# EAGLE design Adafruit ESP8266 Feather (EAGLE 7.7.0)
COMPANY: ADAFRUIT INDUSTRIES; DRAWN: KTOWN; REV: B
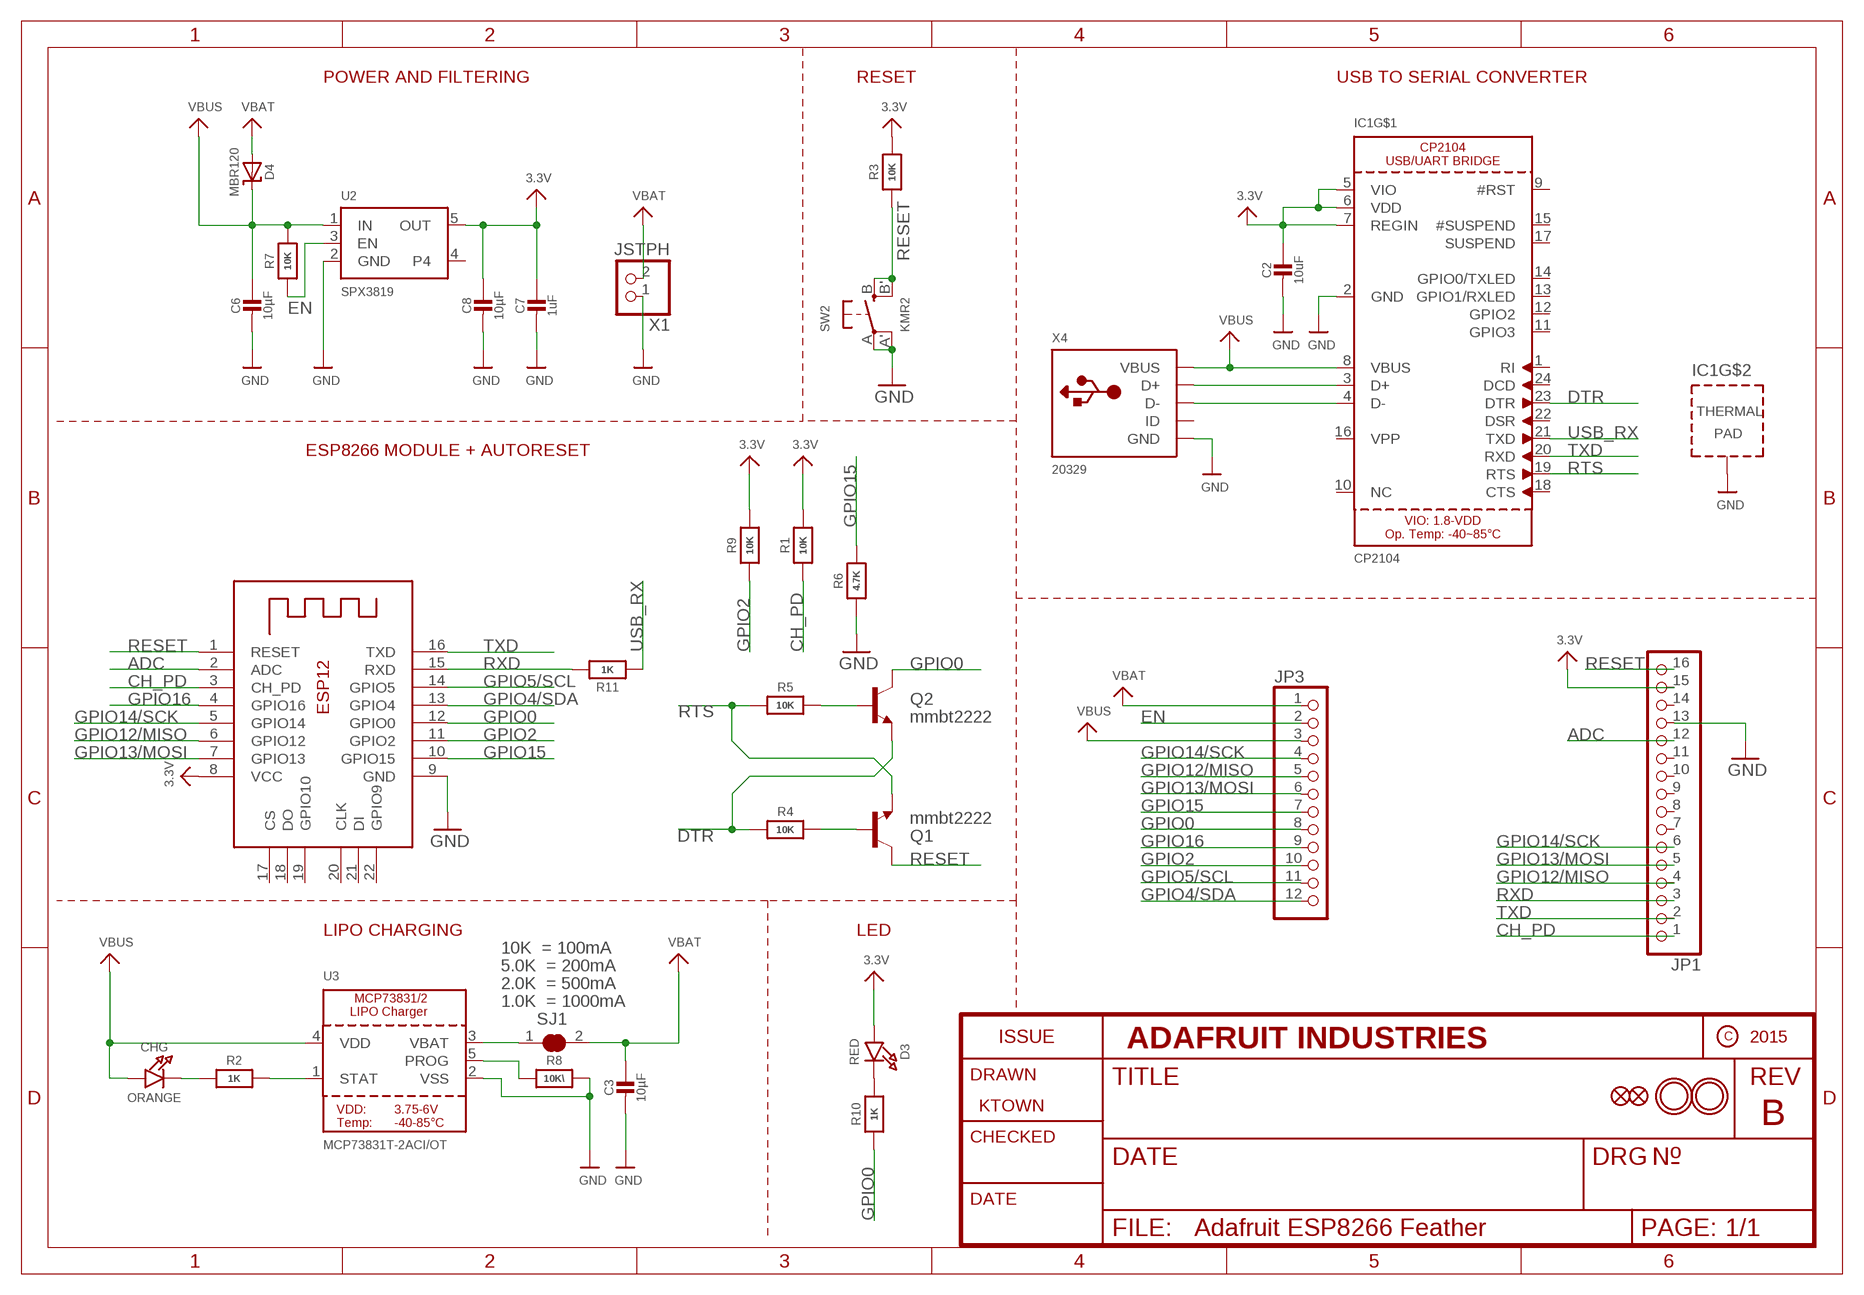
[diagram p0: schematic, sheet 1]

## Parts
C2  10uF  CAP_CERAMIC0805-NOOUTLINE  [0805-NO]
C3  10µF  CAP_CERAMIC0805-NOOUTLINE  [0805-NO]
C6  10µF  CAP_CERAMIC0805-NOOUTLINE  [0805-NO]
C7  1uF  CAP_CERAMIC0603_NO  [0603-NO]
C8  10µF  CAP_CERAMIC0805-NOOUTLINE  [0805-NO]
CHG  ORANGE  LED0805_NOOUTLINE  [CHIPLED_0805_NOOUTLINE]
D3  RED  LED0805_NOOUTLINE  [CHIPLED_0805_NOOUTLINE]
D4  MBR120  DIODE-SCHOTTKYSOD-123  [SOD-123]
IC1  CP2104  [QFN24_4MM_SMSC]
JP1  HEADER-1X16ROUND  [1X16_ROUND]
JP3  HEADER-1X12  [1X12_ROUND]
Q1  mmbt2222  TRANSISTOR_NPNSOT23-3  [SOT23-3]
Q2  mmbt2222  TRANSISTOR_NPNSOT23-3  [SOT23-3]
R1  10K  RESISTOR_0603_NOOUT  [0603-NO]
R2  1K  RESISTOR_0603_NOOUT  [0603-NO]
R3  10K  RESISTOR_0603_NOOUT  [0603-NO]
R4  10K  RESISTOR_0603_NOOUT  [0603-NO]
R5  10K  RESISTOR_0603MP  [_0603MP]
R6  4.7K  RESISTOR_0603_NOOUT  [0603-NO]
R7  10K  RESISTOR_0603_NOOUT  [0603-NO]
R8  10K\  RESISTOR_0603_NOOUT  [0603-NO]
R9  10K  RESISTOR_0603_NOOUT  [0603-NO]
R10  1K  RESISTOR_0603_NOOUT  [0603-NO]
R11  1K  RESISTOR_0603MP  [_0603MP]
SJ1  SOLDERJUMPER_CLOSED  [SOLDERJUMPER_CLOSEDWIRE]
SW2  KMR2  SWITCH_TACT_SMT4.6X2.8  [BTN_KMR2_4.6X2.8]
U2  SPX3819  VREG_SOT23-5  [SOT23-5]
U3  MCP73831T-2ACI/OT  MCP73831/2  [SOT23-5]
U$31  MOUNTINGHOLE2.5  [MOUNTINGHOLE_2.5_PLATED]
U$32  MOUNTINGHOLE2.5  [MOUNTINGHOLE_2.5_PLATED]
U$34  FIDUCIAL""  [FIDUCIAL_1MM]
U$35  FIDUCIAL""  [FIDUCIAL_1MM]
X1  JSTPH  CON_JST_PH_2PIN  [JSTPH2]
X2  ESP-12  ESP-12E  [ESP-12E]
X4  20329  MICRO-USB-SMD-B-(10118193-0001LF)-ADASYM  [MICRO-USB5+6P-SMD-0.65-B]

## Nets
3.3V: C2.1 C7.1 C8.1 D3.A IC1.5(VIO) IC1.6(VDD) IC1.7(REGIN) JP1.15 R1.2 R3.2 R9.2 U2.5(OUT) X2.8(VCC)
ADC: JP1.12 X2.2(ADC)
CH_PD: JP1.1 R1.1 X2.3(CH_PD)
DTR: IC1.23(DTR) Q2.2(E) R4.1
EN: JP3.2 R7.1 U2.3(EN)
GND: C2.2 C3.2 C6.2 C7.2 C8.2 IC1.2(GND) IC1.THERM(TP) JP1.13 R6.1 R8.2 SW2.A'(P1) SW2.A(P) U2.2(GND) U3.2(VSS) X1.1 X2.9(GND) X4.5(GND) X4.S1(GND) X4.S2(GND) X4.S3(GND) X4.S4(GND) X4.S5(GND) X4.S6(GND)
GPIO0: JP3.8 Q2.3(C) R10.1 X2.12(GPIO0)
GPIO2: JP3.10 R9.1 X2.11(GPIO2)
GPIO4/SDA: JP3.12 X2.13(GPIO4)
GPIO5/SCL: JP3.11 X2.14(GPIO5)
GPIO12/MISO: JP1.4 JP3.5 X2.6(GPIO12)
GPIO13/MOSI: JP1.5 JP3.6 X2.7(GPIO13)
GPIO14/SCK: JP1.6 JP3.4 X2.5(GPIO14)
GPIO15: JP3.7 R6.2 X2.10(GPIO15)
GPIO16: JP3.9 X2.4(GPIO16)
N$1: CHG.C R2.1
N$2: IC1.3(D+) X4.3(D+)
N$3: R2.2 U3.1(STAT)
N$4: R8.1 U3.5(PROG)
N$5: D3.C R10.2
N$6: IC1.4(D-) X4.2(D-)
N$7: SJ1.1 U3.3(VBAT)
N$12: Q1.1(B) R4.2
N$13: Q2.1(B) R5.2
RESET: JP1.16 Q1.3(C) R3.1 SW2.B'(S1) SW2.B(S) X2.1(RESET)
RTS: IC1.19(RTS) Q1.2(E) R5.1
RXD: JP1.3 R11.2 X2.15(RXD)
TXD: IC1.20(RXD) JP1.2 X2.16(TXD)
USB_RX: IC1.21(TXD) R11.1
VBAT: C3.1 D4.A JP3.1 SJ1.2 X1.2
VBUS: C6.1 CHG.A D4.C IC1.8(VBUS) JP3.3 R7.2 U2.1(IN) U3.4(VDD) X4.1(VBUS)
Unconnected: IC1.1(RI) IC1.9(#RST) IC1.10(NC) IC1.11(GPIO3) IC1.12(GPIO2) IC1.13(GPIO1/RXLED) IC1.14(GPIO0/TXLED) IC1.15(#SUSPEND) IC1.16(VPP) IC1.17(SUSPEND) IC1.18(CTS) IC1.22(DSR) IC1.24(DCD) JP1.7 JP1.8 JP1.9 JP1.10 JP1.11 JP1.14 U2.4 X2.17(CS) X2.18(DO) X2.19(GPIO10) X2.20(CLK) X2.21(DI) X2.22(GPIO9) X4.4(ID)

## Notes on the sheet
- POWER AND FILTERING | RESET | USB TO SERIAL CONVERTER
- ESP8266 MODULE + AUTORESET
- LIPO CHARGING | LED
- 10K  = 100mA
- 5.0K  = 200mA
- 2.0K  = 500mA
- 1.0K  = 1000mA

## Library data of the parts
C2 C3 C6-C8 = microbuilder:CAP_CERAMIC: Ceramic Capacitors For new designs, use the packages preceded by an '_' character since they are more reliable: The following footprints should be used on most boards: _0402 - Standard footprint for regular board layouts _0603 - Standard footprint for regular board layouts _0805 - Standard footprint for regular board layouts _1206 - Standard footprint for regular board layouts For extremely tight-pitch boards where space is at a premium, the following 'micro-pitch' footprints can be used (smaller pads, no silkscreen outline, etc.): _0402MP - Micro-pitch footprint for very dense/compact boards _0603MP - Micro-pitch footprint for very dense/compact boards _0805MP - Micro-pitch footprint for very dense/compact boards _1206MP - Micro-pitch footprint for very dense/compact boards
CHG D3 = microbuilder:LED: LED 0603 - 0603 Surface Mount Package 2mA: Green LED - Low Power (3.9mcd, 2ma, 1.7Vf) - Digikey: 475-2709-2-ND Orange LED - Low Power (9.8mcd, 2ma, 1.8Vf) - Digikey: 475-1194-2-ND Red LED - Low Power (5mcd, 2ma, 1.8Vf) - Digikey: 475-1195-2-ND Yellow LED - Low Power (7mcd, 2ma, 1.8Vf) - Digikey: 475-1196-2-ND 5mA: Blue LED - Low Power (17mcd, 5ma, 2.9Vf) - Digikey: LNJ937W8CRACT-ND 0805 - 0805 Surface Mount Package 2mA: Red LED (8.8mcd, 2mA, 1.8Vf, Clear) - Low Power [Digikey: 475-2510-1-ND] Green LED (5mcd, 2mA, 1.8Vf, Clear) - Low Power [Digikey: 475-2730-1-ND] Yellow LED (11.3mcd, 2mA, 1.8Vf, Clear) - Low Power [Digikey: 475-2555-1-ND] 20mA: Red LED (104mcd, 20mA, Diffused) - LS R976 [Digikey: 475-1278-6-ND] Red LED (12mcd, 20mA, 2.0Vf, Clear) - APT2012EC [Digikey: 754-1128-1-ND] Green LED (15mcd, 20mA, 2.2Vf, Clear) - APT2012GC [Digikey: 754-1131-1-ND] Orange LED (160mcd, 20mA, 2.1Vf, Clear) - APT2012SECK [Digikey: 754-1130-1-ND] 1206 - 1206 Surface Mount Package Green LED (26mcd, 20mA, Diffused) - LG N971 [Digikey: 475-1407-6-ND] Red LED (15mcd, 20mA, Diffused) - LH N974 [Digikey: 475-1416-6-ND] Cree - Cree High-Power Surface Mount LEDs XPEBWT-L1-0000-00D50 - White 111lm 350mA 2.9Vf 6200K 110° XTEAWT-00-0000-00000LEE3 - White 114lm 350mA 2.85Vf 5000K 115° Everlight - Everlight 45-21 Series Surface Mount LEDs 45-21/QK2C-B2832AC2CB2/2T - Warm White 2000mcd 20mA 3.25Vf 3050K 120° 45-21/LK2C-B38452C4CB2/2T - Nuetral White 2000mcd 20mA 3.25Vf 4150K 120° 45-21/LK2C-B50634C6CB2/2T - Cold White 2200mcd 20mA 3.25Vf 5650K 120° PLCC2 Reverse Mount LS T77K-J1L2-1-0-2-R18-Z - Red 11.25mcd 2mA 1.8Vf 630nm 120° LO T77K-L1M2-24-Z - Orange 19.6mcd 2mA 1.8Vf 606nm 120° LY T77K-K2M1-26-Z - Yellow 15.7mcd 2mA 1.8Vf 587nm 120°
D4 = microbuilder:DIODE-SCHOTTKY
IC1 = microbuilder:CP2104: CP2104 - USB to UART Bridge VDD Output: 3.45V
JP1 = microbuilder:HEADER-1X16: PIN HEADER
JP3 = microbuilder:HEADER-1X12
Q1 Q2 = SparkFun:TRANSISTOR_NPN: Transistor NPN BJT configuration in SOT23 package. MMBT2222 is the common NPN we use. Double check BCE configuration again layout.
R1-R11 = microbuilder:RESISTOR: Resistors For new designs, use the packages preceded by an '_' character since they are more reliable: The following footprints should be used on most boards: _0402 - Standard footprint for regular board layouts _0603 - Standard footprint for regular board layouts _0805 - Standard footprint for regular board layouts _1206 - Standard footprint for regular board layouts For extremely tight-pitch boards where space is at a premium, the following 'micro-pitch' footprints can be used (smaller pads, no silkscreen outline, etc.): _0402MP - Micro-pitch footprint for very dense/compact boards _0603MP - Micro-pitch footprint for very dense/compact boards _0805MP - Micro-pitch footprint for very dense/compact boards _1206MP - Micro-pitch footprint for very dense/compact boards
SJ1 = microbuilder:SOLDERJUMPER_CLOSED: Solder Jumper - Closed These solder jumpers are closed by default CLOSEDWIRE - 10 mil trace between pads that can be cut and resoldered later CLOSEDPERM - 63 mil trace between pads for a permanent connection (used to 'bridge' two signals, a shameless hack for Eagle). Can double as a test point as well (no cream layer)
SW2 = microbuilder:SWITCH_TACT_SMT: SMT Tact Switches 6x6mm - Digikey: P12940SCT-ND KMR2 (4.6x2.8mm) - Digikey: 401-1426-1-ND EVQ-PQHB55 - Light Touch, 160GF (4.5x4.5mm) - Digikey: P8090SCT-ND KMT0 - KMT021 NGJ LHS (etc.) IP68/Waterproof - Digikey: CKN10289CT-ND
U2 = microbuilder:VREG_SOT23-5: SOT23-5 Fixed Voltage Regulators Part Current Out V Out V In V Dropout θJA (°C/W) TJ (°C) Digikey Part No. ADP121 150mA 3.3V 3.4-5.5V 0.09V @ 150mA -- -- ADP121-AUJZ33R7CT-ND ADP121 150mA 3.0V 3.1-5.5V 0.09V @ 150mA -- -- ADP121-AUJZ30R7CT-ND ADP122 300mA 3.3V 3.4-5.5V 0.085V @ 300mA -- -- ADP122AUJZ-3.3-R7CT-ND ADP1712 300mA 3.3V 3.5-5.5V 0.17V @ 300mA -- -- ADP1712AUJZ-3.3-R7TR-ND AP7311 (Low Cost) 150mA 3.3V 3.5-6V 0.15V @ 150mA -- -- AP7311-33WG-7DICT-ND LD39015M18R 150mA 1.8V 1.9V-5.5V 0.08V @ 100mA -- -- 497-6977-1-ND LP2985A-33DBVR 150mA 3.3V 3.3-16V 0.28V @ 150mA 206 150 296-18479-1-ND MCP1824T-3302E/OT 300mA 3.3V 3.5V-6V 0.2V @ 300mA -- -- MCP1824T-3302E/OTCT-ND MIC5205-2.5YM5 TR 150mA 2.5V 2.7-16V 0.165V @ 150mA -- -- 576-1257-2-ND MIC5205-3.0YM5 TR 150mA 3.0V 3.2V-16V 0.165V @ 150mA -- -- 576-1258-2-ND MIC5205-3.3YM5 TR 150mA 3.3V 3.5V-16V 0.165V @ 150mA -- -- 576-1259-2-ND TPS780330220 150mA 3.3V+2.2V 3.6-5.5V 250mV Max -- -- 296-23332-1-ND TDA3663/N1,135 100mA 3.3V 3.5-45V 0.18V @ 50mA -- -- 568-5343-1-ND Max operating temp can be calculated using θJA, TJ (max junction temperature), and power in watts. Set the "Maximum Ambient Temperature" until it reaches TJ ("Max Junction Temperature"), which is the absolute limit for safe use of the regulator: Heat Sink Temperature Calculator <http://www.daycounter.com/Calculators/Heat-Sink-Temperature-Calculator.phtml> For example, With 12V source into a 3.3V LP2985 and a 30mA load, we are dissipating (12V-3.3V) * 0.03A = 0.261W. With a θJA of 206 °C/W, a TJ of 150°C, and 261mW we can safely use the chip without a heat sink up to 75°C (=147.1°C Junction Temperature).
U3 = microbuilder:MCP73831/2: MCP73831/2 LIPO Charger VDD: 3.75 - 6V Temp -40 - 85°C Programmable Charge Rate: 15-500mA NOTE: STAT is a tri-state logic output on the MCP73831 and an open-drain output on the MCP73832. SOT23-5 with 4.2V output and tri-state logic on STAT = MCP73831T-2ACI/OT
U$31 U$32 = microbuilder:MOUNTINGHOLE: Mounting Hole For #2 screws (0.086"/2.18mm width, 0.094"/2.4mm hole) use 2.5mm; BOM: EXCLUDE
U$34 U$35 = microbuilder:FIDUCIAL: Fiducial Alignment Points Various fiducial points for machine vision alignment.; BOM: EXCLUDE
X1 = microbuilder:CON_JST_PH_2PIN: JST 2-Pin Right-Angle Connector PH-Series - 4UConnector: 17311 SH-Series - 4UConnector: 07278
X2 = microbuilder:ESP-12E
X4 = microbuilder:MICRO-USB-SMD-B-(10118193-0001LF)-ADASYM

## Board
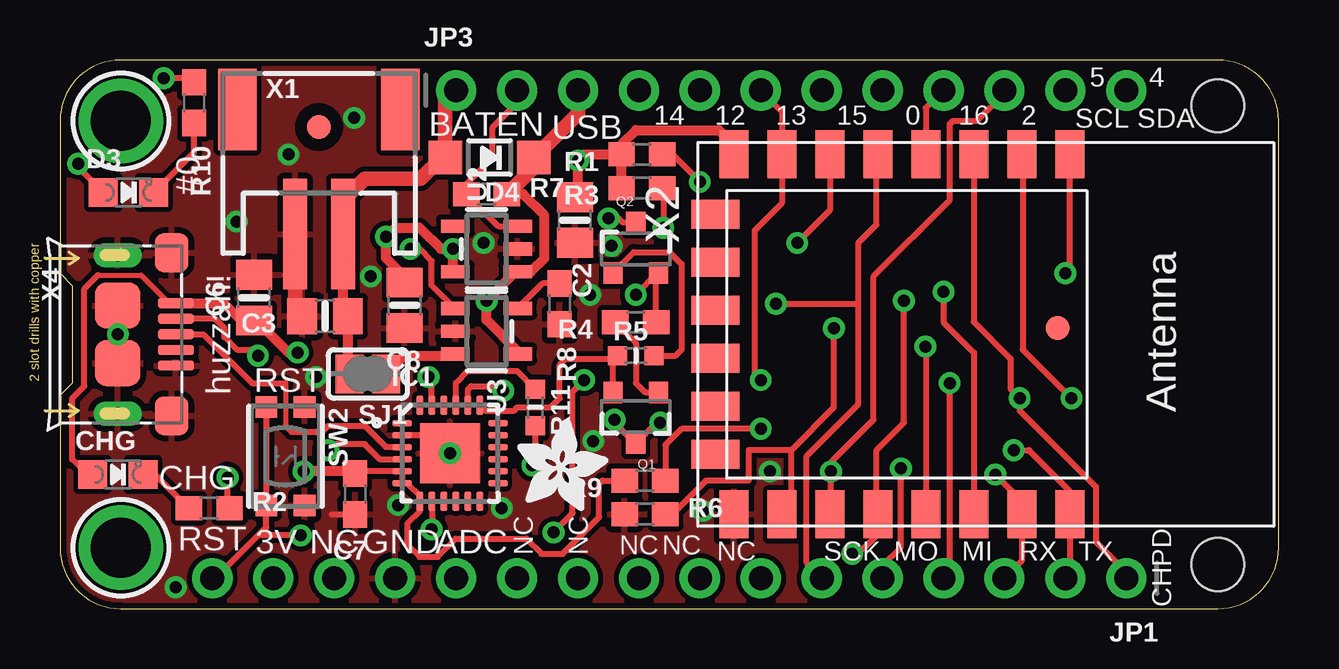
[diagram p1: board, top side]
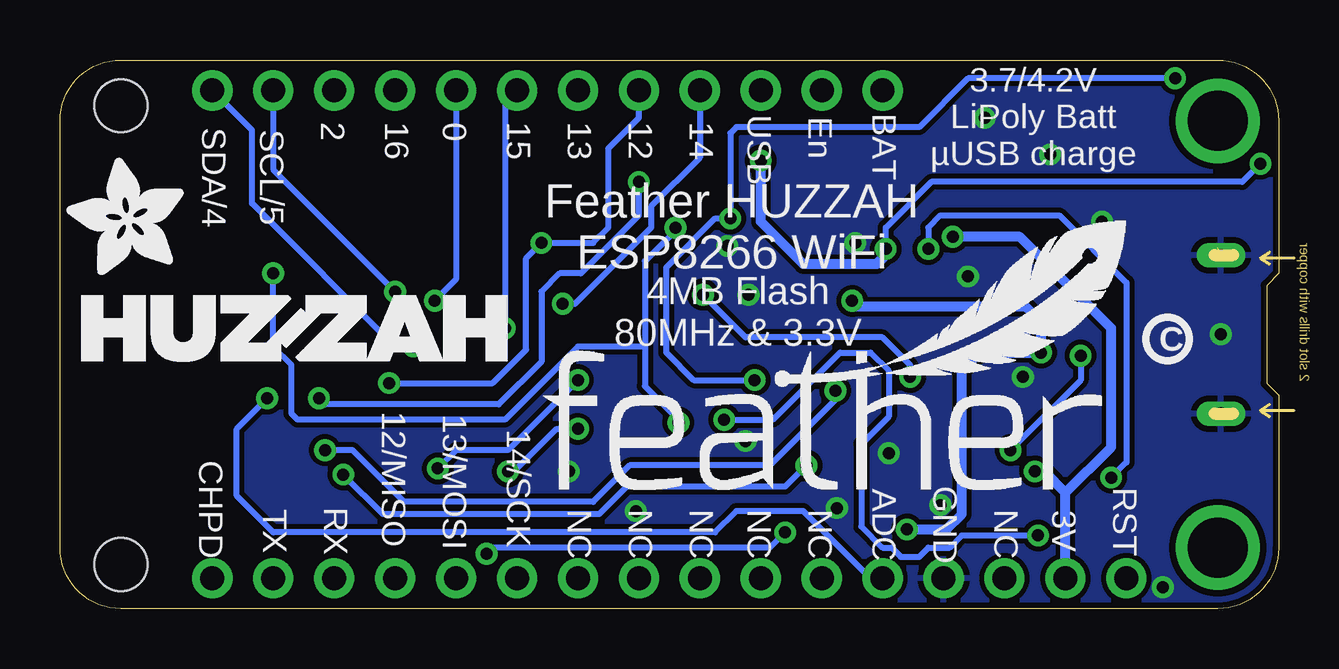
[diagram p2: board, bottom side, seen from below]

Size 50.8 x 22.86 mm. Coordinates in mm from the lower left corner, seen from the top.
Outline: 2.54,0 48.26,0 arc90 50.8,2.54 50.8,20.32 arc90 48.26,22.86 2.54,22.86 arc90 0,20.32 0,13.97 0.51,13.46 0.51,9.4 0,8.89 0,2.54 arc90 2.54,0
Copper layers (1*16): Top 0.035mm / dielectric 1.5mm / Bottom 0.035mm
Design rules "adafruit *": minimum track width 8mil, minimum drill 15.5mil, track to track 8mil, track to pad 8mil, pad to pad 8mil, via to via 8mil, smd to smd 8mil, copper to edge 10mil, drill to drill 8mil, minimum pad ring 10mil, minimum via ring 8mil, stop-mask expansion 2mil, vias tented up to drill 20mil, thermal gap 10mil
Holes 2.2 mm at 48.26,1.84 48.26,20.95

### Footprints (pad centres in the part's own frame; a part is rotated, then mirrored left to right if it is on the bottom)
0805-NO = smd 1.24 x 1.5: 1 -0.95,0; 2 0.95,0
0603-NO = smd 1.1 x 1: 1 -0.85,0; 2 0.85,0
CHIPLED_0805_NOOUTLINE = smd 1.2 x 1.2: A 0,-1.05; C 0,1.05
SOD-123 = smd 1.4 x 1.4: A 1.85,0; C -1.85,0
QFN24_4MM_SMSC = smd 0.8 x 0.28: 1 -2,1.25; 2 -2,0.75; 3 -2,0.25; 4 -2,-0.25; 5 -2,-0.75; 6 -2,-1.25; 13 2,-1.25; 14 2,-0.75; 15 2,-0.25; 16 2,0.25; 17 2,0.75; 18 2,1.25 | smd 0.28 x 0.8: 7 -1.25,-2; 8 -0.75,-2; 9 -0.25,-2; 10 0.25,-2; 11 0.75,-2; 12 1.25,-2; 19 1.25,2; 20 0.75,2; 21 0.25,2; 22 -0.25,2; 23 -0.75,2; 24 -1.25,2 | smd 2.5 x 2.5: THERM 0,0
1X16_ROUND = drill 1 pad 1.676: 1 -19.05,0; 2 -16.51,0; 3 -13.97,0; 4 -11.43,0; 5 -8.89,0; 6 -6.35,0; 7 -3.81,0; 8 -1.27,0; 9 1.27,0; 10 3.81,0; 11 6.35,0; 12 8.89,0; 13 11.43,0; 14 13.97,0; 15 16.51,0; 16 19.05,0
1X12_ROUND = drill 1 pad 1.676: 1 -13.97,0; 2 -11.43,0; 3 -8.89,0; 4 -6.35,0; 5 -3.81,0; 6 -1.27,0; 7 1.27,0; 8 3.81,0; 9 6.35,0; 10 8.89,0; 11 11.43,0; 12 13.97,0
SOT23-3 = smd 0.8 x 0.9: 1 -0.95,-1; 2 0.95,-1; 3 0,1.1
_0603MP = smd 0.8 x 0.8: 1 -0.762,0; 2 0.762,0
SOLDERJUMPER_CLOSEDWIRE = smd 1.168 x 1.6: 1 -0.762,0; 2 0.762,0 | smd 0.635 x 0.203: WIRE 0,0
BTN_KMR2_4.6X2.8 = smd 0.9 x 0.9: A 2.05,0.8; A' -2.05,0.8; B 2.05,-0.8; B' -2.05,-0.8
SOT23-5 = smd 0.55 x 1.2: 1 -0.95,-1.3; 2 0,-1.3; 3 0.95,-1.3; 4 0.95,1.3; 5 -0.95,1.3
MOUNTINGHOLE_2.5_PLATED = drill 2.5 pad 3.2: P$1 0,0
FIDUCIAL_1MM = smd 1 x 1: 1 0,0
JSTPH2 = smd 1 x 4.6: 1 -1,-3.7; 2 1,-3.7 | smd 1.6 x 3.4: NC1 -3.4,1.5; NC2 3.4,1.5
ESP-12E = smd 2 x 1.2: 1 -7.5,5.77; 2 -7.5,3.77; 3 -7.5,1.77; 4 -7.5,-0.23; 5 -7.5,-2.23; 6 -7.5,-4.23; 7 -7.5,-6.23; 8 -7.5,-8.23; 9 7.5,-8.23; 10 7.5,-6.23; 11 7.5,-4.23; 12 7.5,-2.23; 13 7.5,-0.23; 14 7.5,1.77; 15 7.5,3.77; 16 7.5,5.77 | smd 1.2 x 2: 17 -5,-9; 18 -3,-9; 19 -1,-9; 20 1,-9; 21 3,-9; 22 5,-9
MICRO-USB5+6P-SMD-0.65-B = smd 0.4 x 1.5: 1 -1.3,-0.25; 2 -0.65,-0.25; 3 0,-0.25; 4 0.65,-0.25; 5 1.3,-0.25 | smd 1.6 x 1.4: S1 -3.4,-0.427; S6 3.4,-0.427 | drill 0.508 pad 1.016 long: S2 -3.3,-2.675; S5 3.3,-2.675 | smd 1.9 x 1.9: S3 -1.2,-2.675; S4 1.2,-2.675

### Placement (x,y rotation side)
C2  21.46,16.19 270 top
C3  11.05,12.19 180 top
C6  8.09,12.96 90 top
C7  12.3,4.78 270 top
C8  14.37,12.64 270 top
CHG  2.41,5.59 270 top
D3  2.86,17.34 270 top
D4  17.91,18.8 180 top
IC1  16.26,6.48 0 top
JP1  25.4,1.27 180 top
JP3  30.48,21.59 0 top
Q1  24,8 180 top
Q2  24,14.99 0 top
R1  24.26,18.92 180 top
R2  6.22,4.19 0 top
R3  24.26,17.53 180 top
R4  24,11.94 180 top
R5  24,10.54 0 top
R6  24.38,3.94 0 top
R7  17.78,17.27 0 top
R8  20.83,12.7 270 top
R9  24.38,5.33 180 top
R10  5.59,21.08 270 top
R11  19.81,8.38 270 top
SJ1  12.83,9.78 180 top
SW2  9.4,6.35 270 top
U2  17.78,14.99 90 top
U3  17.78,11.56 270 top
U$7  [ADAFRUIT_5MM]  45.66,13.91 90 bottom
U$9  [FEATHERLOGO]  30.67,4.89 0 bottom
U$13  [PCBFEAT-REV-040]  4.64,11.24 0 bottom
U$15  [ADAFRUIT_3.5MM]  19.05,4.06 0 top
U$23  [HUZZAHLOGO]  49.91,10.29 0 bottom
U$31  2.54,20.32 270 top
U$32  2.54,2.54 270 top
U$34  10.79,20.07 270 top
U$35  41.58,11.69 270 top
X1  10.79,19.3 0 top
X2  36.32,11.43 270 top
X4  5.08,11.43 270 top

### Tracks (layer width: path | path; a pad name or v marks a point on that pad's centre or on a via)
3.3V  (via drill 0.5)
  Top 0.254: R1.2 23.41,18.96 | R9.2 22.61,5.33 22.48,5.21 22.48,3.81 20.95,2.29 20.07,2.29 19.43,2.92 16.51,2.92 15.75,2.16 14.99,2.16 14.48,2.67 14.48,3.56 15.01,4.08 IC1.7 15.01,4.68 14.46,5.23 IC1.6 IC1.5 12.53,5.73 | 28.09,19.31 X2.8 | D3.A 0.76,18.38 v0.76,18.54
  Top 0.406: R3.2 R1.2 | R1.2 23.41,19.34 24,19.94 27.46,19.94 28.09,19.31 | R1.2 21.84,18.92 v21.59,18.67 21.59,17.27 C2.1 | U2.5 16.48,14.16 16.38,14.26 v16.38,14.99 15.88,14.99 14.99,15.88 13.97,15.88 v13.59,15.49 13.59,14.61 14.37,13.83 C8.1 | 12.53,5.73 12.43,5.62 C7.1 12.21,5.71 v10.16,5.71
  Bottom 0.254: v0.76,18.54 1.52,17.78 14.48,17.78 16.38,15.88 v16.38,14.99 16.38,14.73
  Bottom 0.406: 8.89,4.83 6.99,6.73 6.99,11.68 10.79,15.49 v13.59,15.49 | JP1.15 8.89,4.83 | 8.89,4.83 9.78,5.71 v10.16,5.71 | 16.38,14.73 16.76,14.35 19.81,14.35 21.59,16.13 v21.59,18.67
ADC  (via drill 0.5)
  Top 0.254: X2.2 40.13,18.89 40.13,10.79 v42.16,8.76
  Bottom 0.254: JP1.12 17.02,1.27 19.81,4.06 22.61,4.06 23.5,3.17 41.91,3.17 43.43,4.7 43.43,7.49 v42.16,8.76
CH_PD  (via drill 0.5)
  Top 0.254: 25.4,18.92 R1.1 25.53,18.92 v26.67,17.78 | X2.3 38.09,11.95 39.62,10.41 39.62,9.14 v40.01,8.76 40.01,8.26 43.18,5.08 43.18,2.79 44.45,1.52 JP1.1
  Bottom 0.254: v26.67,17.78 26.67,16.38 29.08,13.97 29.97,13.97 30.73,13.21 30.73,10.29 32.51,8.51 39.75,8.51 v40.01,8.76
DTR  (via drill 0.5)
  Top 0.254: R4.1 24.85,13.99 Q2.2 24.91,13.99 v24,13.08 | IC1.23 15.49,8.49 15.49,9.53 v15.37,9.65
  Bottom 0.254: v15.37,9.65 15.37,10.16 16.51,11.3 22.23,11.3 v24,13.08
EN
  Top 0.254: JP3.2 19.05,21.08 18.03,20.07 18.03,18.8 16.93,17.69 R7.1 18.27,15.94 U2.3
GND  (via drill 0.5)  (1 unrouted)
  Top 0.254: 1.59,15.03 2.54,15.03 | IC1.2 16,7.23 16,6.73 IC1.THERM | 11.34,3.92 C7.2 | 13.84,11.43 14.22,11.43
  Top 0.406: C8.2 14.37,11.57 14.22,11.43
  Top 0.61: C3.2 9.79,12.5 X1.1
  other vias: 2.41,11.43 12.95,13.84 22.99,15.11 12.26,20.45 10.67,9.65 16.26,6.48 18.41,4.19 22.23,6.99 26.8,4.06 4.83,0.89 7.37,16.13 9.53,18.92 14.1,4.32 22.1,13.08 17.65,15.24 29.59,5.71
  pour Top: 0,22.86 0,0 43.18,0 43.18,22.86
  pour Bottom: -0.13,0.25 43.18,0 43.18,22.86 0,22.86
GPIO0  (via drill 0.5)
  Top 0.254: Q2.3 23.45,16.09 23.28,16.26 v22.86,16.26 | v21.84,9.53 21.34,9.02 21.34,4.01 21.37,3.98 v20.57,3.17 | R10.1 5.42,22.1 v4.32,22.1 | v33.02,2.29 33.02,2.03 34.09,3.1 X2.12 34.04,3.99 34.04,6.6 35.18,7.75 v35.18,12.83
  Bottom 0.254: v4.32,22.1 12.95,22.1 14.99,20.07 22.61,20.07 22.86,19.81 v22.86,16.26 23.5,16.26 25.53,14.22 25.53,10.67 24.38,9.53 v21.84,9.53 | v20.57,3.17 21.21,2.54 32.77,2.54 v33.02,2.29 | JP3.8 34.29,13.72 v35.18,12.83
GPIO2  (via drill 0.5)
  Top 0.254: R9.1 25.23,6.82 25.91,7.49 v29.21,7.49 | JP3.10 39.37,21.46 38.23,20.32 37.21,20.32 37.08,20.19 37.08,17.02 33.91,13.84 33.91,7.87 32.13,6.1 v32.13,5.71 32.13,3.97 X2.11
  Bottom 0.254: v32.13,5.71 31.88,5.71 30.1,7.49 v29.21,7.49
GPIO4/SDA  (via drill 0.5)
  Top 0.254: X2.13 36.09,10.9 v36.07,10.92
  Bottom 0.254: v36.07,10.92 36.83,10.92 42.8,16.89 42.8,19.94 JP3.12
GPIO5/SCL  (via drill 0.5)
  Top 0.254: v36.83,13.21 36.83,11.94 38.1,10.67 X2.14
  Bottom 0.254: JP3.11 41.91,18.29 v36.83,13.21
GPIO12/MISO  (via drill 0.5)
  Top 0.254: X2.6 32.09,16.6 v30.73,15.24 | JP1.4 37.08,1.52 v37.08,9.4
  Bottom 0.254: JP3.5 26.67,20.45 27.94,19.18 27.94,15.88 28.57,15.24 v30.73,15.24 31.37,14.61 31.37,10.79 32.77,9.4 v37.08,9.4
GPIO13/MOSI  (via drill 0.5)
  Top 0.254: JP1.5 34.29,1.78 35.05,2.54 v35.05,5.84 | JP3.6 30.09,20.71 X2.7 30.09,16.88 28.96,15.75 28.96,9.78 v29.21,9.53
  Bottom 0.254: v29.21,9.53 32.13,6.6 34.29,6.6 v35.05,5.84
GPIO14/SCK  (via drill 0.5)
  Top 0.254: 33.27,12.7 33.27,15.24 34.04,16 34.04,18.87 X2.5 | v29.84,12.7 33.27,12.7 | JP1.6 31.11,1.91 31.11,6.35 33.27,8.51 33.27,12.7
  Bottom 0.254: JP3.4 24.13,18.8 26.16,16.76 26.16,15.88 29.34,12.7 v29.84,12.7
GPIO15  (via drill 0.5)
  Top 0.254: R6.2 25.53,3.94 26.92,5.33 28.7,5.33 28.7,6.6 30.48,6.6 | 30.48,6.6 30.48,4.32 X2.10 | 30.48,6.6 32.26,8.38 v32.26,11.68
  Bottom 0.254: JP3.7 32.26,21.08 v32.26,11.68
GPIO16
  Top 0.254: JP3.9 36.09,20.85 X2.4
N$1
  Top 0.254: CHG.C 3.98,5.59 R2.1
N$2
  Top 0.203: 9.4,9.4 9.4,7.62
  Top 0.254: IC1.3 13.59,6.73 12.7,7.62 11.18,7.62 10.92,7.37 9.65,7.37 9.4,7.62 | X4.3 5.97,11.43 8,9.4 9.4,9.4
N$3  (via drill 0.5)
  Top 0.254: v14.61,14.99 14.99,14.99 15.49,14.48 15.49,13.46 16.45,12.51 U3.1 | R2.2 6.99,4.28 v6.99,5.46
  Bottom 0.254: v6.99,5.46 6.35,6.1 6.35,13.59 9.14,16.38 14.1,16.38 14.61,15.88 v14.61,14.99
N$4
  Top 0.254: R8.1 20.12,13.55 U3.5
N$5
  Top 0.254: D3.C 5.59,19.02 R10.2
N$6  (via drill 0.5)
  Top 0.254: IC1.4 13.33,6.23 12.7,6.86 11.43,6.86 v11.18,6.6 | X4.2 6.46,12.08 6.86,11.68 6.86,11.3 7.37,10.79 8,10.79 v8.26,10.54
  Bottom 0.254: v8.26,10.54 8.26,9.53 v11.18,6.6
N$7
  Top 0.406: SJ1.1 14.35,10.54 16.41,10.54 U3.3
N$12
  Top 0.254: R4.2 23.15,11.9 24,11.05 24,9.4 24.38,9.02 24.94,9.02 Q1.1
N$13
  Top 0.254: R5.2 25.65,10.54 25.91,10.79 25.91,14.35 25.4,14.86 23.93,14.86 Q2.1
RESET  (via drill 0.5)
  Top 0.254: JP1.16 6.48,1.27 8.26,3.05 | SW2.B' SW2.B 8.6,3.39 8.26,3.05 | v10.03,3.05 8.26,3.05 | R3.1 25.15,17.49 v25.15,15.88 | v23.11,7.87 23.11,7.75 23.96,6.9 Q1.3 24.85,7.75 v25.02,7.75 | v41.91,13.97 42.09,14.15 X2.1
  Bottom 0.254: 26.42,11.05 26.42,14.48 25.15,15.75 v25.15,15.88 | 26.42,11.05 26.42,9.27 25.02,7.87 v25.02,7.75 | v23.11,7.87 21.08,7.87 18.29,10.67 17.02,10.67 16.26,9.91 16.26,8 17.4,6.86 17.4,3.43 16.51,2.54 16.13,2.54 15.75,2.16 14.99,2.16 14.61,2.54 13.72,2.54 13.21,3.05 v10.03,3.05 | 26.42,11.05 26.54,10.92 29.21,10.92 32.26,7.87 40.89,7.87 41.15,8.13 41.15,10.16 41.91,10.92 v41.91,13.97
RTS
  Top 0.254: IC1.19 17.73,8.26 18.92,8.26 19.05,8.38 20.45,8.38 20.83,8.76 20.83,10.16 21.08,10.41 23.11,10.41 | Q1.2 23.05,10.35 23.11,10.41 | 23.11,10.41 R5.1
RXD  (via drill 0.5)
  Top 0.254: JP1.3 40.09,1.99 X2.15 40.09,4.49 v38.99,5.59 | R11.2 19.81,6.1 v19.68,5.97
  Bottom 0.254: v19.68,5.97 20.57,5.08 27.18,5.08 28.32,3.94 37.34,3.94 v38.99,5.59
TXD  (via drill 0.5)
  Top 0.254: IC1.20 17.01,9.13 17.14,9.27 18.29,9.27 v18.48,9.08 | JP1.2 42.09,1.45 X2.16 42.09,4.9 40.39,6.6 v39.75,6.6
  Bottom 0.254: v39.75,6.6 38.61,6.6 36.45,4.45 28.57,4.45 27.05,5.97 21.21,5.97 18.48,8.7 v18.48,9.08
USB_RX
  Top 0.254: IC1.21 16.51,9.39 17.02,9.91 19.05,9.91 R11.1
VBAT
  Top 0.254: 11.68,16.26 11.94,16
  Top 0.406: 11.94,16 11.94,15.75 X1.2 11.79,12.4 C3.1 12,9.85 SJ1.2 | 11.68,16.89 11.68,16.26
  Top 0.61: 11.68,16.89 12.7,17.91 15.04,17.91 15.93,18.8 D4.A 16.06,21.14 JP3.1
VBUS  (via drill 0.5)
  Top 0.203: 4.54,12.73 3.38,13.89 1.57,13.89
  Top 0.254: CHG.A 1.14,5.59 0.51,6.22 0.51,8.76 1.02,9.27 1.02,13.34 1.57,13.89 | IC1.8 15.51,3.29 v15.49,3.3 | 5.19,12.7 X4.1 4.54,12.73
  Top 0.406: X4.1 6.83,12.73 7.55,12.01 C6.1 8.18,12.01 9.53,10.67 v9.91,10.67 | R7.2 19.3,17.27 20.19,16.38 20.19,14.61 19.62,14.04 U2.1 18.99,14.04 v17.78,12.83 17.78,12.03 19.08,10.73 U3.4
  Top 0.61: R7.2 19.76,18.4 D4.C 21.59,20.63 JP3.3
  Bottom 0.254: 17.78,12.57 v17.78,12.83
  Bottom 0.406: v15.49,3.3 13.84,3.3 13.21,3.94 13.21,9.91 12.45,10.67 v9.91,10.67 9.91,11.94 10.54,12.57 17.78,12.57

### Text on the board
tPlace: 5 | 4 | 14 | 12 | 13 | 15 | 0 | 16 | 2 | BAT | EN | USB | SCL | SDA | #0 | huzzah! | RST | CHG | RST | 3V | NC | GND | ADC | NC | NC | NC | NC | NC | SCK | MO | MI | RX | TX | CHPD
bPlace: 3.7/4.2V / LiPoly Batt / µUSB charge | En | 0 | 2 | BAT | USB | 14 | 12 | 13 | 15 | 16 | SCL/5 | SDA/4 | Feather HUZZAH / ESP8266 WiFi | 4MB Flash / 80MHz & 3.3V | 14/SCK | 13/MOSI | 12/MISO | RST | CHPD | 3V | NC | GND | ADC | NC | NC | NC | NC | NC | RX | TX